# EAGLE design keyboard-8 (EAGLE 9.5.1)

## Sheet 1 of 3
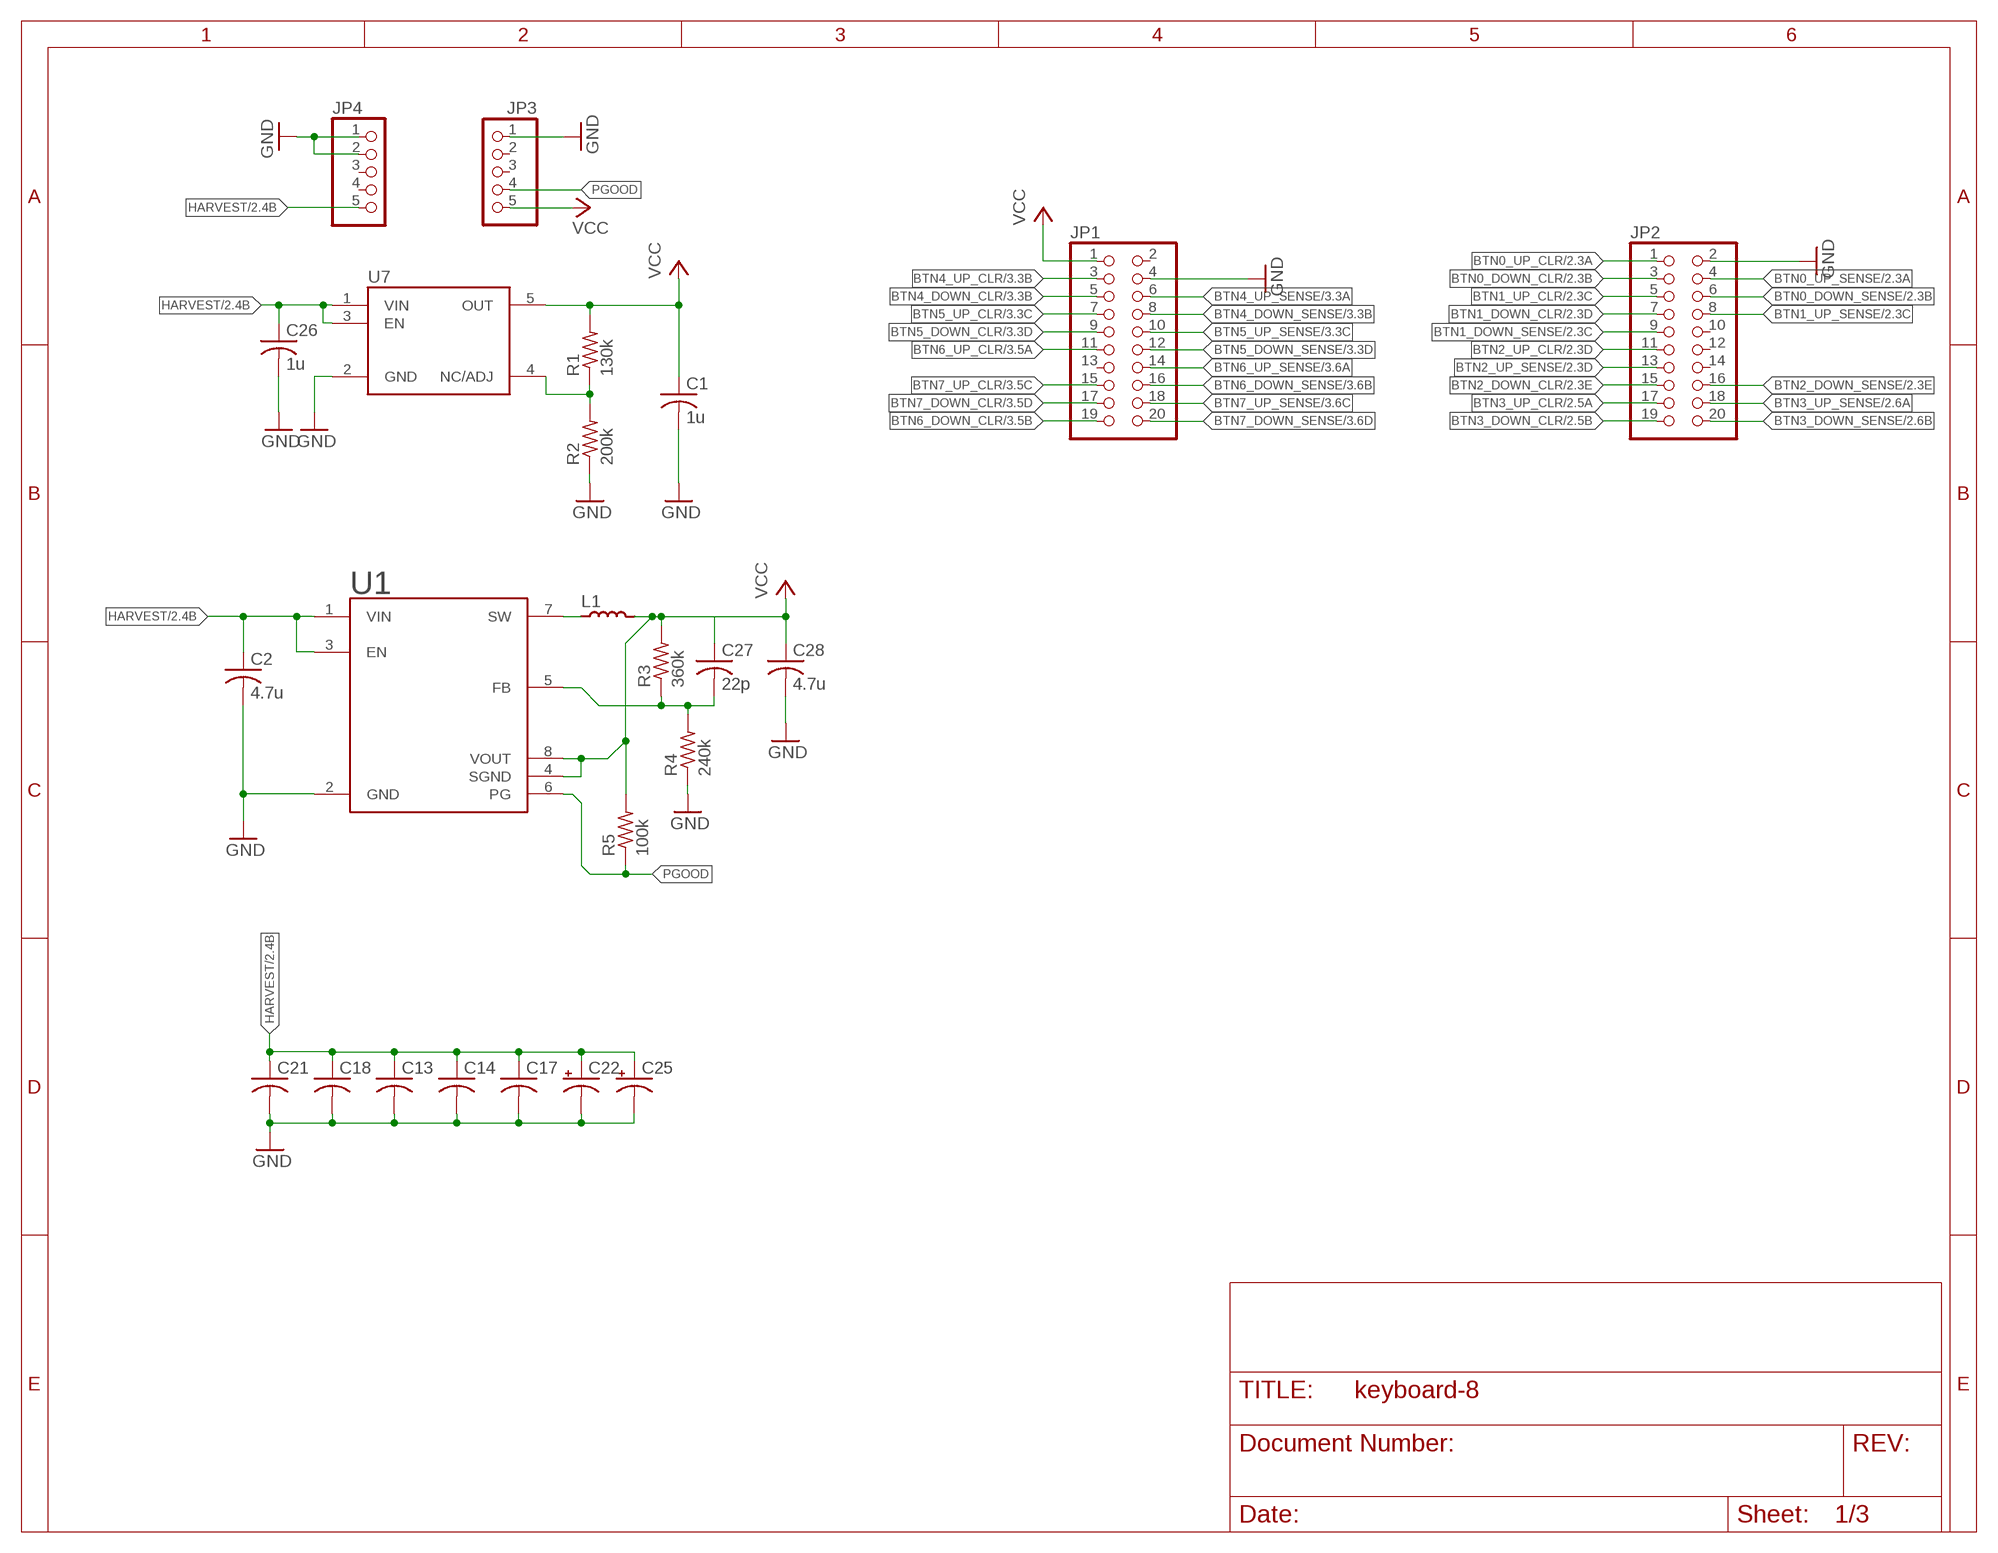
[diagram p0: schematic, sheet 1]

### Parts
C1  1u  C-USC0402  [C0402]
C2  4.7u  C-USC0603  [C0603]
C13  C-USC1206  [C1206]
C14  C-USC1206  [C1206]
C17  C-USC1206  [C1206]
C18  C-USC0805  [C0805]
C21  C-USC0805  [C0805]
C22  CPOL-USE2-5  [E2-5]
C25  CPOL-USE2-5  [E2-5]
C26  1u  C-USC0402  [C0402]
C27  22p  C-USC0402  [C0402]
C28  4.7u  C-USC0603  [C0603]
JP1  PINHD-2X10  [2X10]
JP2  PINHD-2X10  [2X10]
JP3  PINHD-1X5  [1X05]
JP4  PINHD-1X5  [1X05]
L1  22u  LQH3NPN220MMEL  [LQH3NPNXXXXMEX]
R1  130k  R-US_R0603  [R0603]
R2  200k  R-US_R0603  [R0603]
R3  360k  R-US_R0402  [R0402]
R4  240k  R-US_R0402  [R0402]
R5  100k  R-US_R0402  [R0402]
U1  TPS62120  [SOP65P280X145-8N]
U7  MIC5225  [MIC5225]

### Nets
BTN0_DOWN_CLR [btn]: JP2.3 ; also sheet 2
BTN0_DOWN_SENSE [btn]: JP2.6 ; also sheet 2
BTN0_UP_CLR [btn]: JP2.1 ; also sheet 2
BTN0_UP_SENSE [btn]: JP2.4 ; also sheet 2
BTN1_DOWN_CLR [btn]: JP2.7 ; also sheet 2
BTN1_DOWN_SENSE [btn]: JP2.9 ; also sheet 2
BTN1_UP_CLR [btn]: JP2.5 ; also sheet 2
BTN1_UP_SENSE [btn]: JP2.8 ; also sheet 2
BTN2_DOWN_CLR [btn]: JP2.15 ; also sheet 2
BTN2_DOWN_SENSE [btn]: JP2.16 ; also sheet 2
BTN2_UP_CLR [btn]: JP2.11 ; also sheet 2
BTN2_UP_SENSE [btn]: JP2.13 ; also sheet 2
BTN3_DOWN_CLR [btn]: JP2.19 ; also sheet 2
BTN3_DOWN_SENSE [btn]: JP2.20 ; also sheet 2
BTN3_UP_CLR [btn]: JP2.17 ; also sheet 2
BTN3_UP_SENSE [btn]: JP2.18 ; also sheet 2
BTN4_DOWN_CLR [btn]: JP1.5 ; also sheet 3
BTN4_DOWN_SENSE [btn]: JP1.8 ; also sheet 3
BTN4_UP_CLR [btn]: JP1.3 ; also sheet 3
BTN4_UP_SENSE [btn]: JP1.6 ; also sheet 3
BTN5_DOWN_CLR [btn]: JP1.9 ; also sheet 3
BTN5_DOWN_SENSE [btn]: JP1.12 ; also sheet 3
BTN5_UP_CLR [btn]: JP1.7 ; also sheet 3
BTN5_UP_SENSE [btn]: JP1.10 ; also sheet 3
BTN6_DOWN_CLR [btn]: JP1.19 ; also sheet 3
BTN6_DOWN_SENSE [btn]: JP1.16 ; also sheet 3
BTN6_UP_CLR [btn]: JP1.11 ; also sheet 3
BTN6_UP_SENSE [btn]: JP1.14 ; also sheet 3
BTN7_DOWN_CLR [btn]: JP1.17 ; also sheet 3
BTN7_DOWN_SENSE [btn]: JP1.20 ; also sheet 3
BTN7_UP_CLR [btn]: JP1.15 ; also sheet 3
BTN7_UP_SENSE [btn]: JP1.18 ; also sheet 3
GND: C1.2 C2.2 C13.2 C14.2 C17.2 C18.2 C21.2 C22.- C25.- C26.2 C28.2 JP1.4 JP2.2 JP3.1 JP4.1 JP4.2 R2.1 R4.1 U1.2(GND) U7.2(GND) ; also sheet 2,3
HARVEST: C2.1 C13.1 C14.1 C17.1 C18.1 C21.1 C22.+ C25.+ C26.1 JP4.5 U1.1(VIN) U1.3(EN) U7.1(VIN) U7.3(EN) ; also sheet 2,3
N$3: R1.1 R2.2 U7.4(NC/ADJ)
N$4: C27.2 R3.1 R4.2 U1.5(FB)
N$5: L1.P$1 U1.7(SW)
PGOOD: JP3.4 R5.1 U1.6(PG)
VCC: C1.1 C27.1 C28.1 JP1.1 JP3.5 L1.P$2 R1.2 R3.2 R5.2 U1.4(SGND) U1.8(VOUT) U7.5(OUT) ; also sheet 2,3
Unconnected: JP1.2 JP1.13 JP2.10 JP2.12 JP2.14 JP3.2 JP3.3 JP4.3 JP4.4

## Sheet 2 of 3
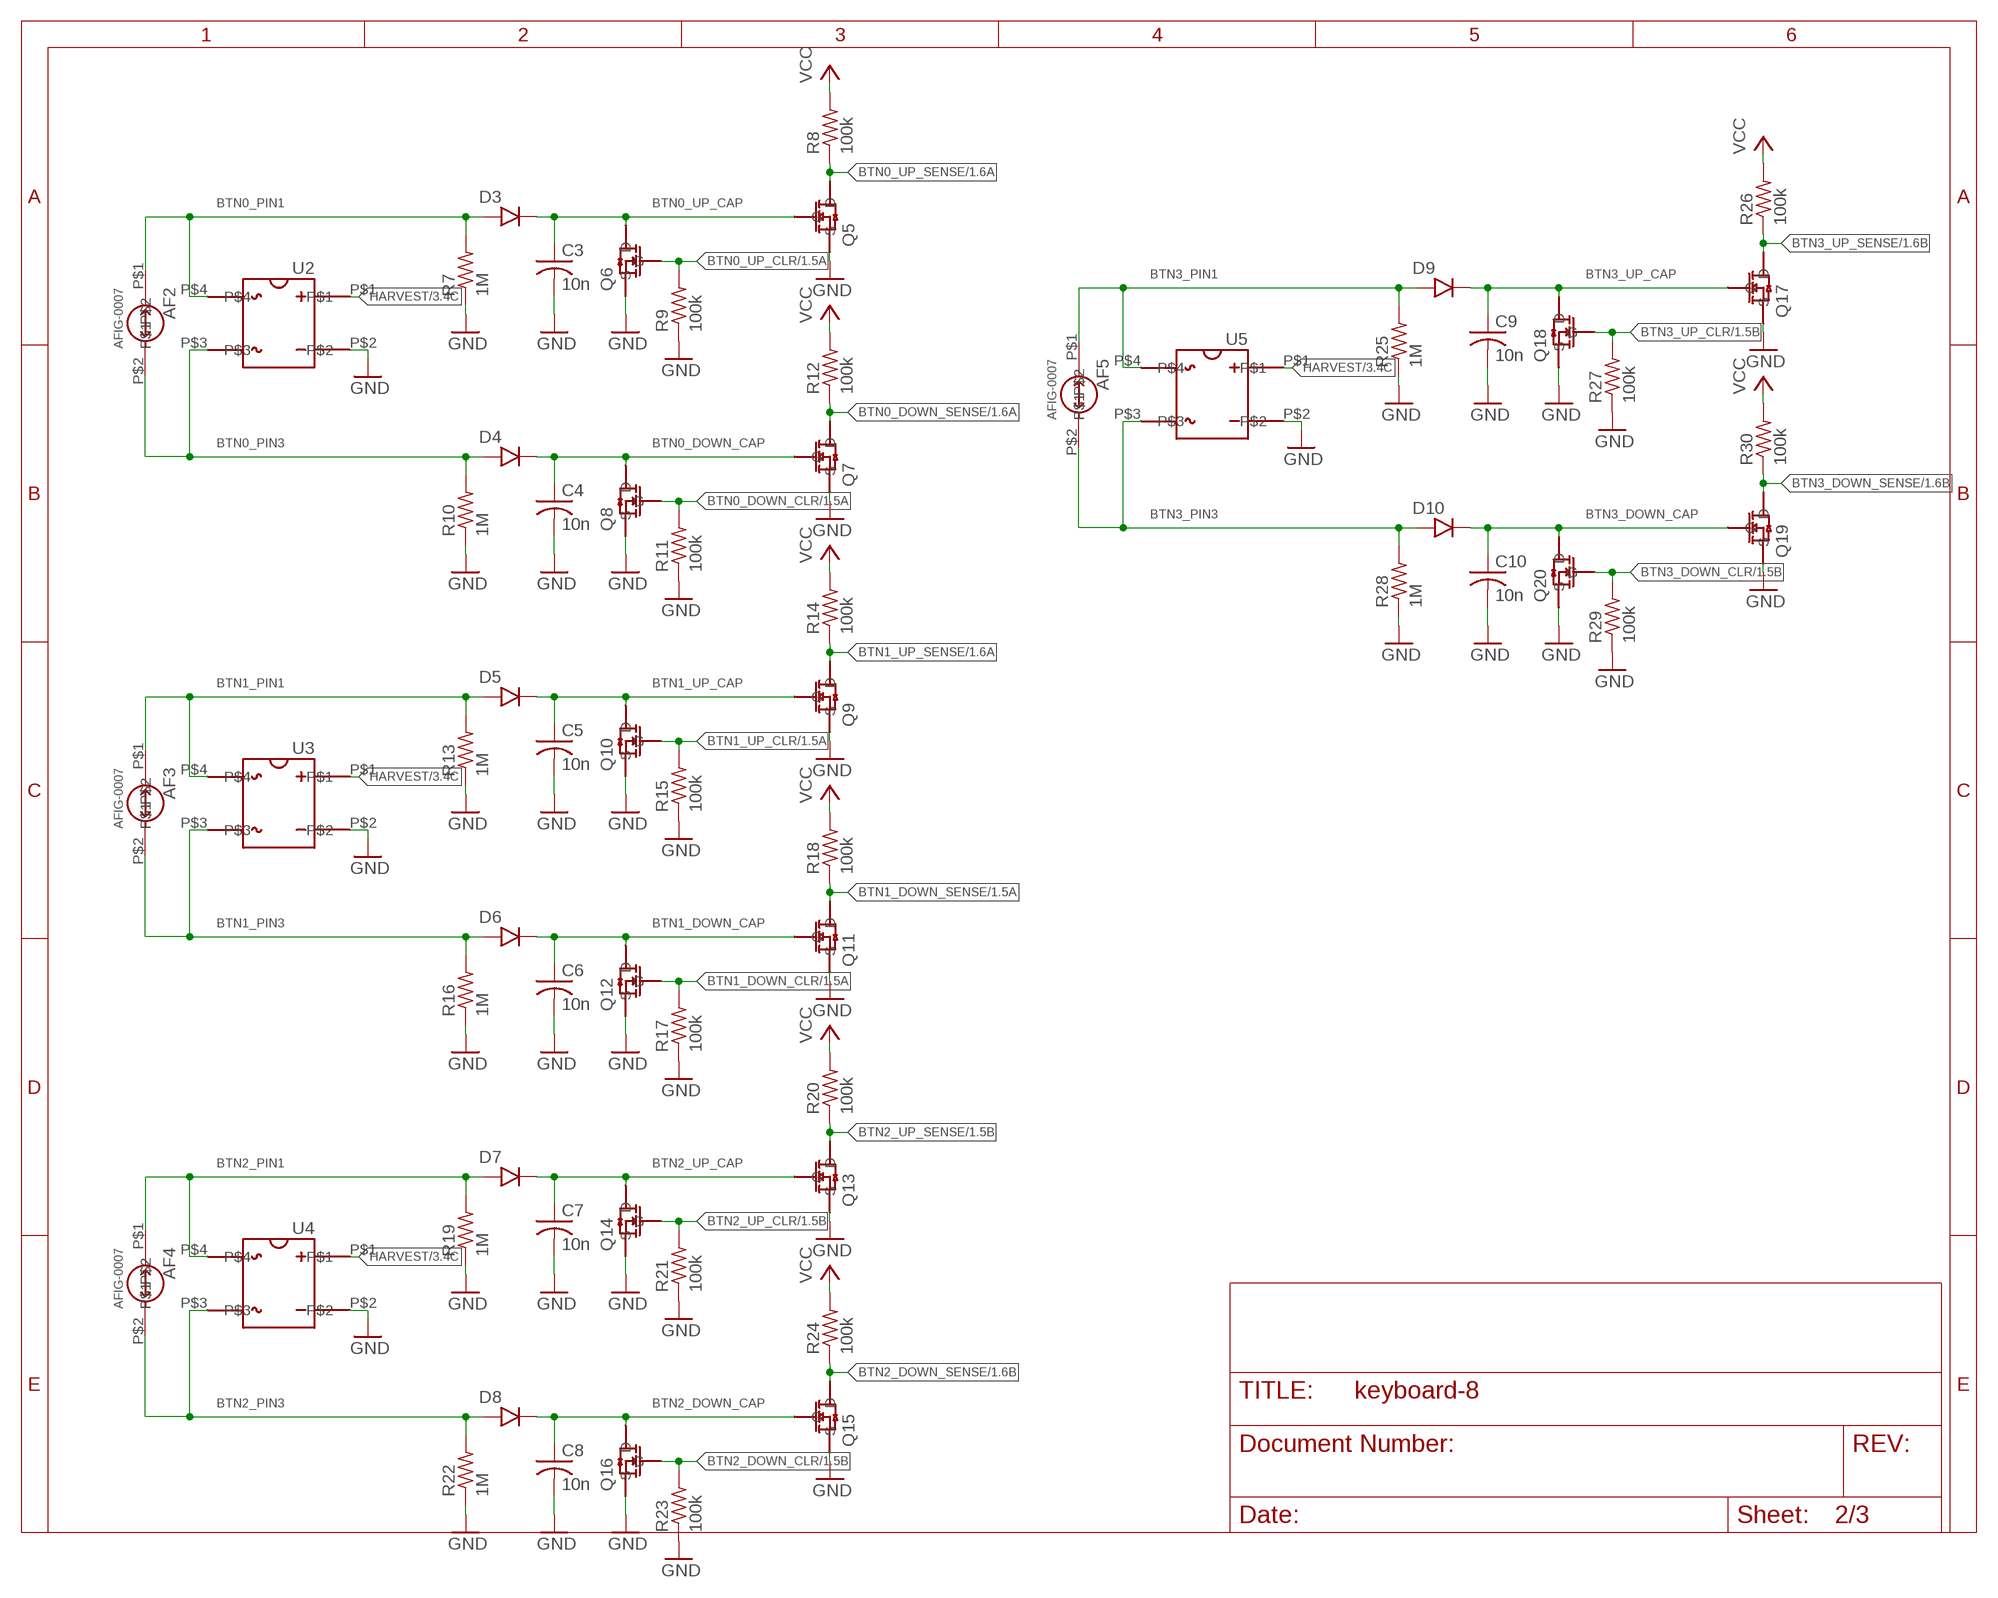
[diagram p1: schematic, sheet 2]

### Parts
AF2  BUTTON-MOUNT  [BUTTON-MOUNT]
AF3  BUTTON-MOUNT  [BUTTON-MOUNT]
AF4  BUTTON-MOUNT  [BUTTON-MOUNT]
AF5  BUTTON-MOUNT  [BUTTON-MOUNT]
C3  10n  C-USC0402  [C0402]
C4  10n  C-USC0402  [C0402]
C5  10n  C-USC0402  [C0402]
C6  10n  C-USC0402  [C0402]
C7  10n  C-USC0402  [C0402]
C8  10n  C-USC0402  [C0402]
C9  10n  C-USC0402  [C0402]
C10  10n  C-USC0402  [C0402]
D3  DFLU1200  [DFLU1200]
D4  DFLU1200  [DFLU1200]
D5  DFLU1200  [DFLU1200]
D6  DFLU1200  [DFLU1200]
D7  DFLU1200  [DFLU1200]
D8  DFLU1200  [DFLU1200]
D9  DFLU1200  [DFLU1200]
D10  DFLU1200  [DFLU1200]
Q5  2N7002K-7  [2N7002K-7]
Q6  BSS138K  [BSS138K]
Q7  2N7002K-7  [2N7002K-7]
Q8  BSS138K  [BSS138K]
Q9  2N7002K-7  [2N7002K-7]
Q10  BSS138K  [BSS138K]
Q11  2N7002K-7  [2N7002K-7]
Q12  BSS138K  [BSS138K]
Q13  2N7002K-7  [2N7002K-7]
Q14  BSS138K  [BSS138K]
Q15  2N7002K-7  [2N7002K-7]
Q16  BSS138K  [BSS138K]
Q17  2N7002K-7  [2N7002K-7]
Q18  BSS138K  [BSS138K]
Q19  2N7002K-7  [2N7002K-7]
Q20  BSS138K  [BSS138K]
R7  1M  R-US_R0402  [R0402]
R8  100k  R-US_R0402  [R0402]
R9  100k  R-US_R0402  [R0402]
R10  1M  R-US_R0402  [R0402]
R11  100k  R-US_R0402  [R0402]
R12  100k  R-US_R0402  [R0402]
R13  1M  R-US_R0402  [R0402]
R14  100k  R-US_R0402  [R0402]
R15  100k  R-US_R0402  [R0402]
R16  1M  R-US_R0402  [R0402]
R17  100k  R-US_R0402  [R0402]
R18  100k  R-US_R0402  [R0402]
R19  1M  R-US_R0402  [R0402]
R20  100k  R-US_R0402  [R0402]
R21  100k  R-US_R0402  [R0402]
R22  1M  R-US_R0402  [R0402]
R23  100k  R-US_R0402  [R0402]
R24  100k  R-US_R0402  [R0402]
R25  1M  R-US_R0402  [R0402]
R26  100k  R-US_R0402  [R0402]
R27  100k  R-US_R0402  [R0402]
R28  1M  R-US_R0402  [R0402]
R29  100k  R-US_R0402  [R0402]
R30  100k  R-US_R0402  [R0402]
U2  CDBHD140L-G  [CDBHDXX0L-G]
U3  CDBHD140L-G  [CDBHDXX0L-G]
U4  CDBHD140L-G  [CDBHDXX0L-G]
U5  CDBHD140L-G  [CDBHDXX0L-G]

### Nets
BTN0_DOWN_CAP [btn]: C4.1 D4.K Q7.G Q8.D
BTN0_DOWN_CLR [btn]: Q8.G R11.2 ; also sheet 1
BTN0_DOWN_SENSE [btn]: Q7.D R12.1 ; also sheet 1
BTN0_PIN1 [btn]: AF2.P$1 D3.A R7.2 U2.P$4
BTN0_PIN3 [btn]: AF2.P$2 D4.A R10.2 U2.P$3
BTN0_UP_CAP [btn]: C3.1 D3.K Q5.G Q6.D
BTN0_UP_CLR [btn]: Q6.G R9.2 ; also sheet 1
BTN0_UP_SENSE [btn]: Q5.D R8.1 ; also sheet 1
BTN1_DOWN_CAP [btn]: C6.1 D6.K Q11.G Q12.D
BTN1_DOWN_CLR [btn]: Q12.G R17.2 ; also sheet 1
BTN1_DOWN_SENSE [btn]: Q11.D R18.1 ; also sheet 1
BTN1_PIN1 [btn]: AF3.P$1 D5.A R13.2 U3.P$4
BTN1_PIN3 [btn]: AF3.P$2 D6.A R16.2 U3.P$3
BTN1_UP_CAP [btn]: C5.1 D5.K Q9.G Q10.D
BTN1_UP_CLR [btn]: Q10.G R15.2 ; also sheet 1
BTN1_UP_SENSE [btn]: Q9.D R14.1 ; also sheet 1
BTN2_DOWN_CAP [btn]: C8.1 D8.K Q15.G Q16.D
BTN2_DOWN_CLR [btn]: Q16.G R23.2 ; also sheet 1
BTN2_DOWN_SENSE [btn]: Q15.D R24.1 ; also sheet 1
BTN2_PIN1 [btn]: AF4.P$1 D7.A R19.2 U4.P$4
BTN2_PIN3 [btn]: AF4.P$2 D8.A R22.2 U4.P$3
BTN2_UP_CAP [btn]: C7.1 D7.K Q13.G Q14.D
BTN2_UP_CLR [btn]: Q14.G R21.2 ; also sheet 1
BTN2_UP_SENSE [btn]: Q13.D R20.1 ; also sheet 1
BTN3_DOWN_CAP [btn]: C10.1 D10.K Q19.G Q20.D
BTN3_DOWN_CLR [btn]: Q20.G R29.2 ; also sheet 1
BTN3_DOWN_SENSE [btn]: Q19.D R30.1 ; also sheet 1
BTN3_PIN1 [btn]: AF5.P$1 D9.A R25.2 U5.P$4
BTN3_PIN3 [btn]: AF5.P$2 D10.A R28.2 U5.P$3
BTN3_UP_CAP [btn]: C9.1 D9.K Q17.G Q18.D
BTN3_UP_CLR [btn]: Q18.G R27.2 ; also sheet 1
BTN3_UP_SENSE [btn]: Q17.D R26.1 ; also sheet 1
GND: C3.2 C4.2 C5.2 C6.2 C7.2 C8.2 C9.2 C10.2 Q5.S Q6.S Q7.S Q8.S Q9.S Q10.S Q11.S Q12.S Q13.S Q14.S Q15.S Q16.S Q17.S Q18.S Q19.S Q20.S R7.1 R9.1 R10.1 R11.1 R13.1 R15.1 R16.1 R17.1 R19.1 R21.1 R22.1 R23.1 R25.1 R27.1 R28.1 R29.1 U2.P$2 U3.P$2 U4.P$2 U5.P$2 ; also sheet 1,3
HARVEST: U2.P$1 U3.P$1 U4.P$1 U5.P$1 ; also sheet 1,3
VCC: R8.2 R12.2 R14.2 R18.2 R20.2 R24.2 R26.2 R30.2 ; also sheet 1,3

## Sheet 3 of 3
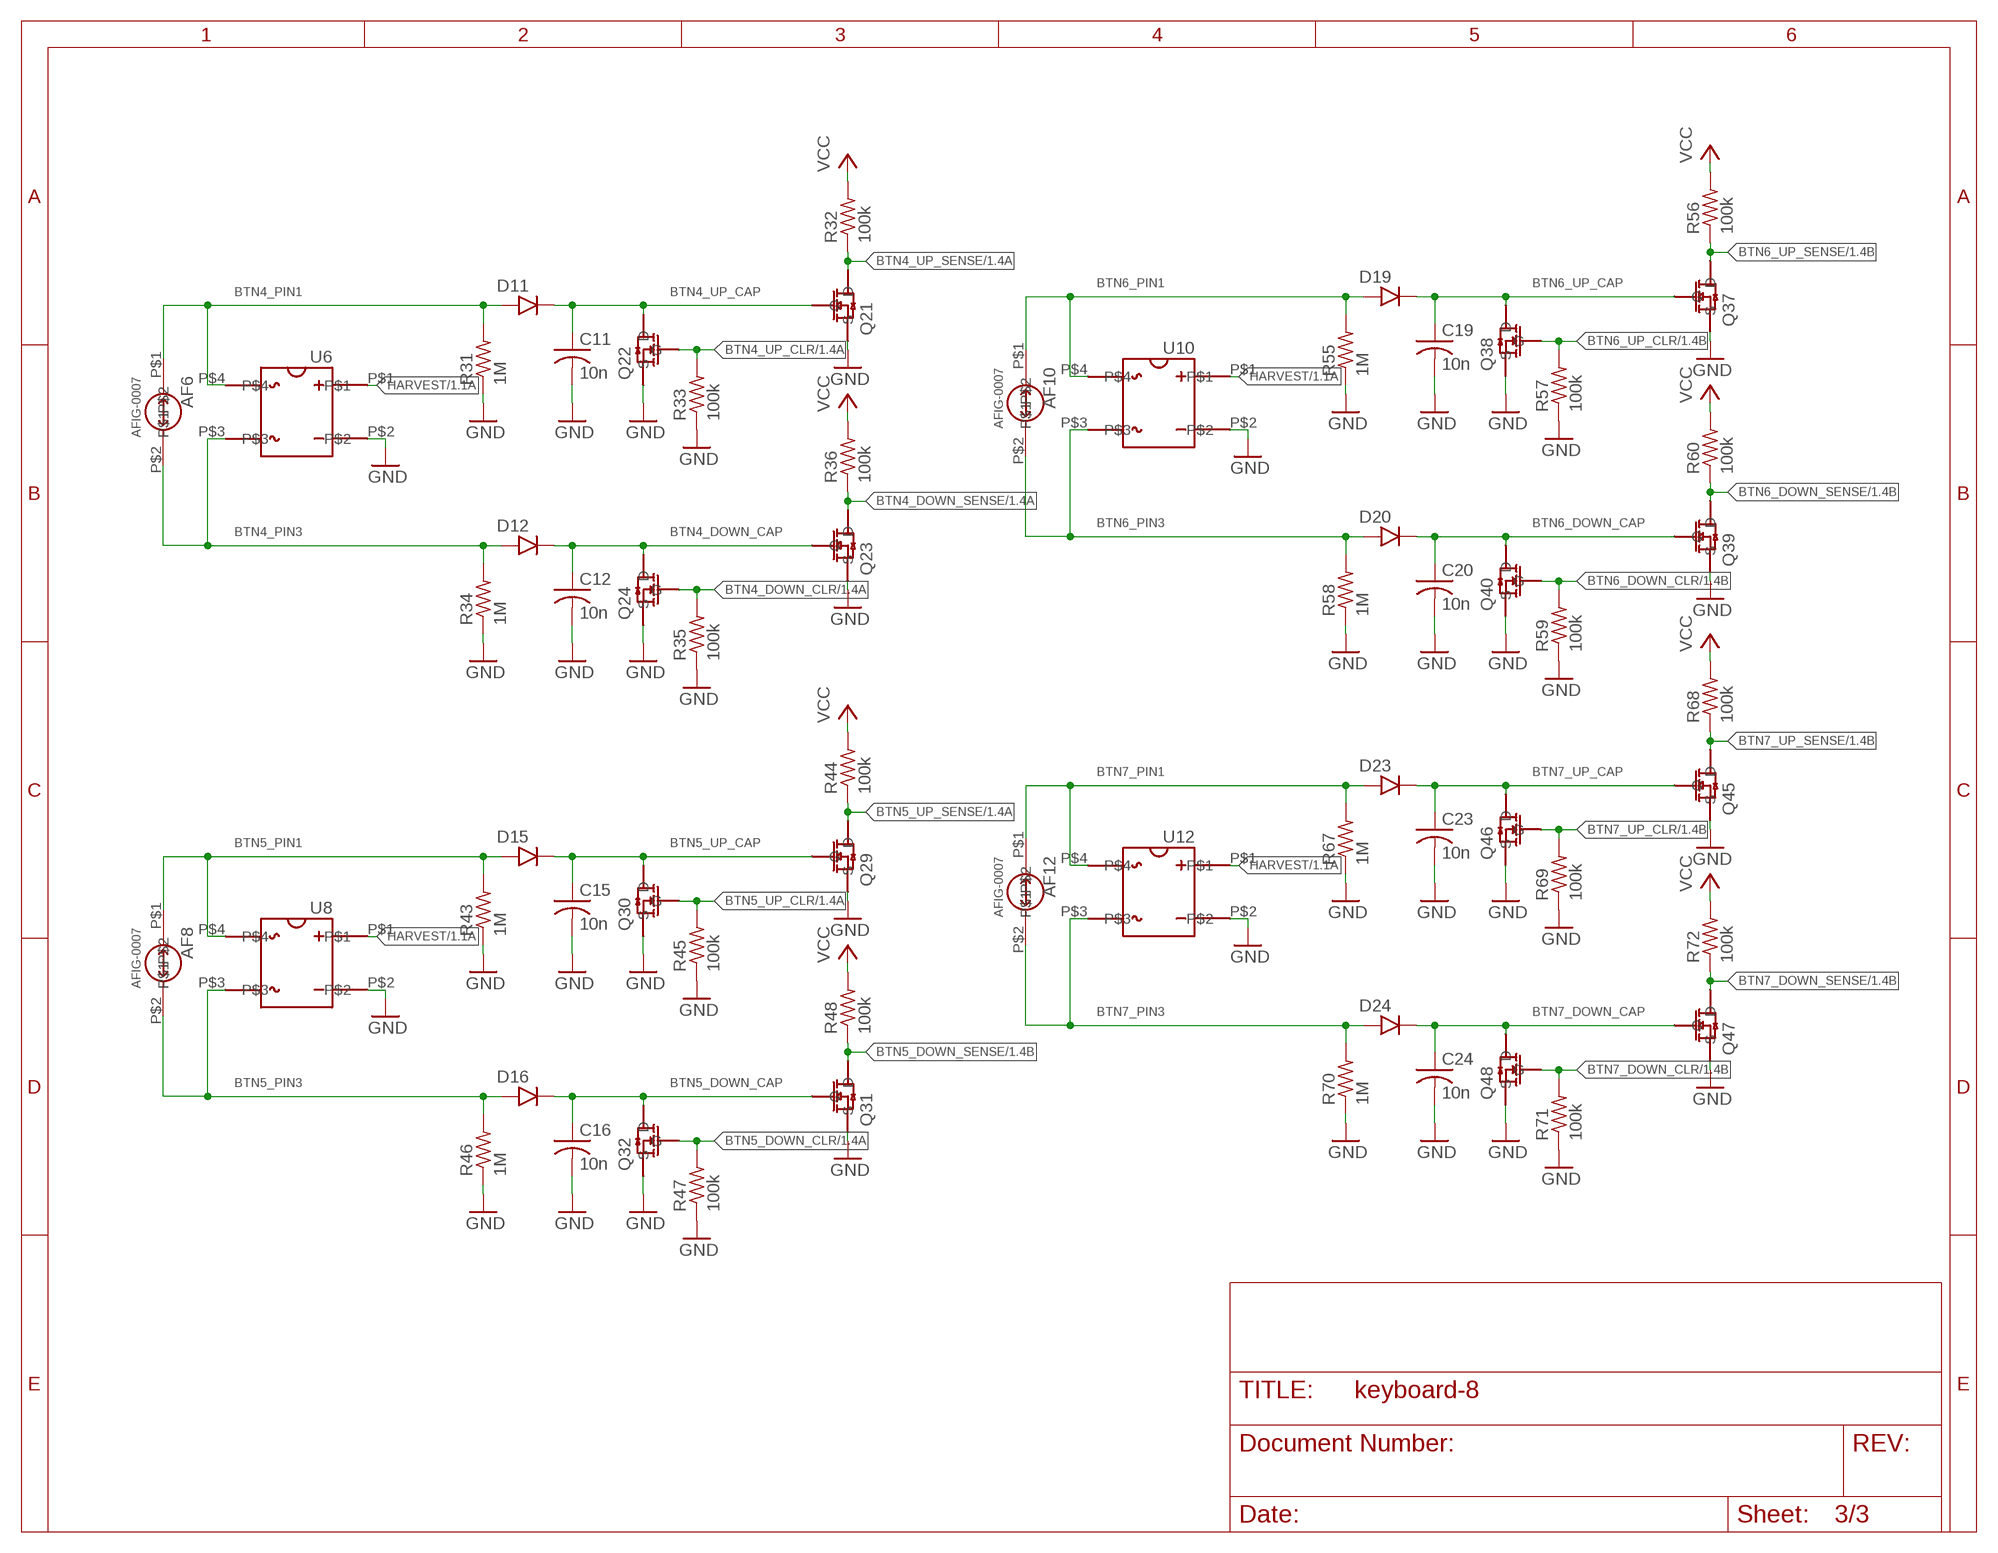
[diagram p2: schematic, sheet 3]

### Parts
AF6  BUTTON-MOUNT  [BUTTON-MOUNT]
AF8  BUTTON-MOUNT  [BUTTON-MOUNT]
AF10  BUTTON-MOUNT  [BUTTON-MOUNT]
AF12  BUTTON-MOUNT  [BUTTON-MOUNT]
C11  10n  C-USC0402  [C0402]
C12  10n  C-USC0402  [C0402]
C15  10n  C-USC0402  [C0402]
C16  10n  C-USC0402  [C0402]
C19  10n  C-USC0402  [C0402]
C20  10n  C-USC0402  [C0402]
C23  10n  C-USC0402  [C0402]
C24  10n  C-USC0402  [C0402]
D11  DFLU1200  [DFLU1200]
D12  DFLU1200  [DFLU1200]
D15  DFLU1200  [DFLU1200]
D16  DFLU1200  [DFLU1200]
D19  DFLU1200  [DFLU1200]
D20  DFLU1200  [DFLU1200]
D23  DFLU1200  [DFLU1200]
D24  DFLU1200  [DFLU1200]
Q21  2N7002K-7  [2N7002K-7]
Q22  BSS138K  [BSS138K]
Q23  2N7002K-7  [2N7002K-7]
Q24  BSS138K  [BSS138K]
Q29  2N7002K-7  [2N7002K-7]
Q30  BSS138K  [BSS138K]
Q31  2N7002K-7  [2N7002K-7]
Q32  BSS138K  [BSS138K]
Q37  2N7002K-7  [2N7002K-7]
Q38  BSS138K  [BSS138K]
Q39  2N7002K-7  [2N7002K-7]
Q40  BSS138K  [BSS138K]
Q45  2N7002K-7  [2N7002K-7]
Q46  BSS138K  [BSS138K]
Q47  2N7002K-7  [2N7002K-7]
Q48  BSS138K  [BSS138K]
R31  1M  R-US_R0402  [R0402]
R32  100k  R-US_R0402  [R0402]
R33  100k  R-US_R0402  [R0402]
R34  1M  R-US_R0402  [R0402]
R35  100k  R-US_R0402  [R0402]
R36  100k  R-US_R0402  [R0402]
R43  1M  R-US_R0402  [R0402]
R44  100k  R-US_R0402  [R0402]
R45  100k  R-US_R0402  [R0402]
R46  1M  R-US_R0402  [R0402]
R47  100k  R-US_R0402  [R0402]
R48  100k  R-US_R0402  [R0402]
R55  1M  R-US_R0402  [R0402]
R56  100k  R-US_R0402  [R0402]
R57  100k  R-US_R0402  [R0402]
R58  1M  R-US_R0402  [R0402]
R59  100k  R-US_R0402  [R0402]
R60  100k  R-US_R0402  [R0402]
R67  1M  R-US_R0402  [R0402]
R68  100k  R-US_R0402  [R0402]
R69  100k  R-US_R0402  [R0402]
R70  1M  R-US_R0402  [R0402]
R71  100k  R-US_R0402  [R0402]
R72  100k  R-US_R0402  [R0402]
U6  CDBHD140L-G  [CDBHDXX0L-G]
U8  CDBHD140L-G  [CDBHDXX0L-G]
U10  CDBHD140L-G  [CDBHDXX0L-G]
U12  CDBHD140L-G  [CDBHDXX0L-G]

### Nets
BTN4_DOWN_CAP [btn]: C12.1 D12.K Q23.G Q24.D
BTN4_DOWN_CLR [btn]: Q24.G R35.2 ; also sheet 1
BTN4_DOWN_SENSE [btn]: Q23.D R36.1 ; also sheet 1
BTN4_PIN1 [btn]: AF6.P$1 D11.A R31.2 U6.P$4
BTN4_PIN3 [btn]: AF6.P$2 D12.A R34.2 U6.P$3
BTN4_UP_CAP [btn]: C11.1 D11.K Q21.G Q22.D
BTN4_UP_CLR [btn]: Q22.G R33.2 ; also sheet 1
BTN4_UP_SENSE [btn]: Q21.D R32.1 ; also sheet 1
BTN5_DOWN_CAP [btn]: C16.1 D16.K Q31.G Q32.D
BTN5_DOWN_CLR [btn]: Q32.G R47.2 ; also sheet 1
BTN5_DOWN_SENSE [btn]: Q31.D R48.1 ; also sheet 1
BTN5_PIN1 [btn]: AF8.P$1 D15.A R43.2 U8.P$4
BTN5_PIN3 [btn]: AF8.P$2 D16.A R46.2 U8.P$3
BTN5_UP_CAP [btn]: C15.1 D15.K Q29.G Q30.D
BTN5_UP_CLR [btn]: Q30.G R45.2 ; also sheet 1
BTN5_UP_SENSE [btn]: Q29.D R44.1 ; also sheet 1
BTN6_DOWN_CAP [btn]: C20.1 D20.K Q39.G Q40.D
BTN6_DOWN_CLR [btn]: Q40.G R59.2 ; also sheet 1
BTN6_DOWN_SENSE [btn]: Q39.D R60.1 ; also sheet 1
BTN6_PIN1 [btn]: AF10.P$1 D19.A R55.2 U10.P$4
BTN6_PIN3 [btn]: AF10.P$2 D20.A R58.2 U10.P$3
BTN6_UP_CAP [btn]: C19.1 D19.K Q37.G Q38.D
BTN6_UP_CLR [btn]: Q38.G R57.2 ; also sheet 1
BTN6_UP_SENSE [btn]: Q37.D R56.1 ; also sheet 1
BTN7_DOWN_CAP [btn]: C24.1 D24.K Q47.G Q48.D
BTN7_DOWN_CLR [btn]: Q48.G R71.2 ; also sheet 1
BTN7_DOWN_SENSE [btn]: Q47.D R72.1 ; also sheet 1
BTN7_PIN1 [btn]: AF12.P$1 D23.A R67.2 U12.P$4
BTN7_PIN3 [btn]: AF12.P$2 D24.A R70.2 U12.P$3
BTN7_UP_CAP [btn]: C23.1 D23.K Q45.G Q46.D
BTN7_UP_CLR [btn]: Q46.G R69.2 ; also sheet 1
BTN7_UP_SENSE [btn]: Q45.D R68.1 ; also sheet 1
GND: C11.2 C12.2 C15.2 C16.2 C19.2 C20.2 C23.2 C24.2 Q21.S Q22.S Q23.S Q24.S Q29.S Q30.S Q31.S Q32.S Q37.S Q38.S Q39.S Q40.S Q45.S Q46.S Q47.S Q48.S R31.1 R33.1 R34.1 R35.1 R43.1 R45.1 R46.1 R47.1 R55.1 R57.1 R58.1 R59.1 R67.1 R69.1 R70.1 R71.1 U6.P$2 U8.P$2 U10.P$2 U12.P$2 ; also sheet 1,2
HARVEST: U6.P$1 U8.P$1 U10.P$1 U12.P$1 ; also sheet 1,2
VCC: R32.2 R36.2 R44.2 R48.2 R56.2 R60.2 R68.2 R72.2 ; also sheet 1,2

## Library data of the parts
AF2-AF6 AF8 AF10 AF12 = afig-0007:BUTTON-MOUNT
C1-C21 C23 C24 C26-C28 = rcl:C-US: CAPACITOR, American symbol; SPICEPREFIX: C
C22 C25 = rcl:CPOL-US: POLARIZED CAPACITOR, American symbol; SPICEPREFIX: C
D3-D12 D15 D16 D19 D20 D23 D24 = afig-0007:DFLU1200
JP1 JP2 = pinhead:PINHD-2X10: PIN HEADER
JP3 JP4 = pinhead:PINHD-1X5: PIN HEADER
L1 = afig-0007:LQH3NPN220MMEL
Q5 Q7 Q9 Q11 Q13 Q15 Q17 Q19 Q21 Q23 Q29 Q31 Q37 Q39 Q45 Q47 = afig-0007:2N7002K-7
Q6 Q8 Q10 Q12 Q14 Q16 Q18 Q20 Q22 Q24 Q30 Q32 Q38 Q40 Q46 Q48 = afig-0007:BSS138K
R1-R5 R7-R36 R43-R48 R55-R60 R67-R72 = rcl:R-US_: RESISTOR, American symbol; SPICEPREFIX: R
U1 = afig-0007:TPS62120
U2-U6 U8 U10 U12 = afig-0007:CDBHD140L-G
U7 = afig-0007:MIC5225

## Board
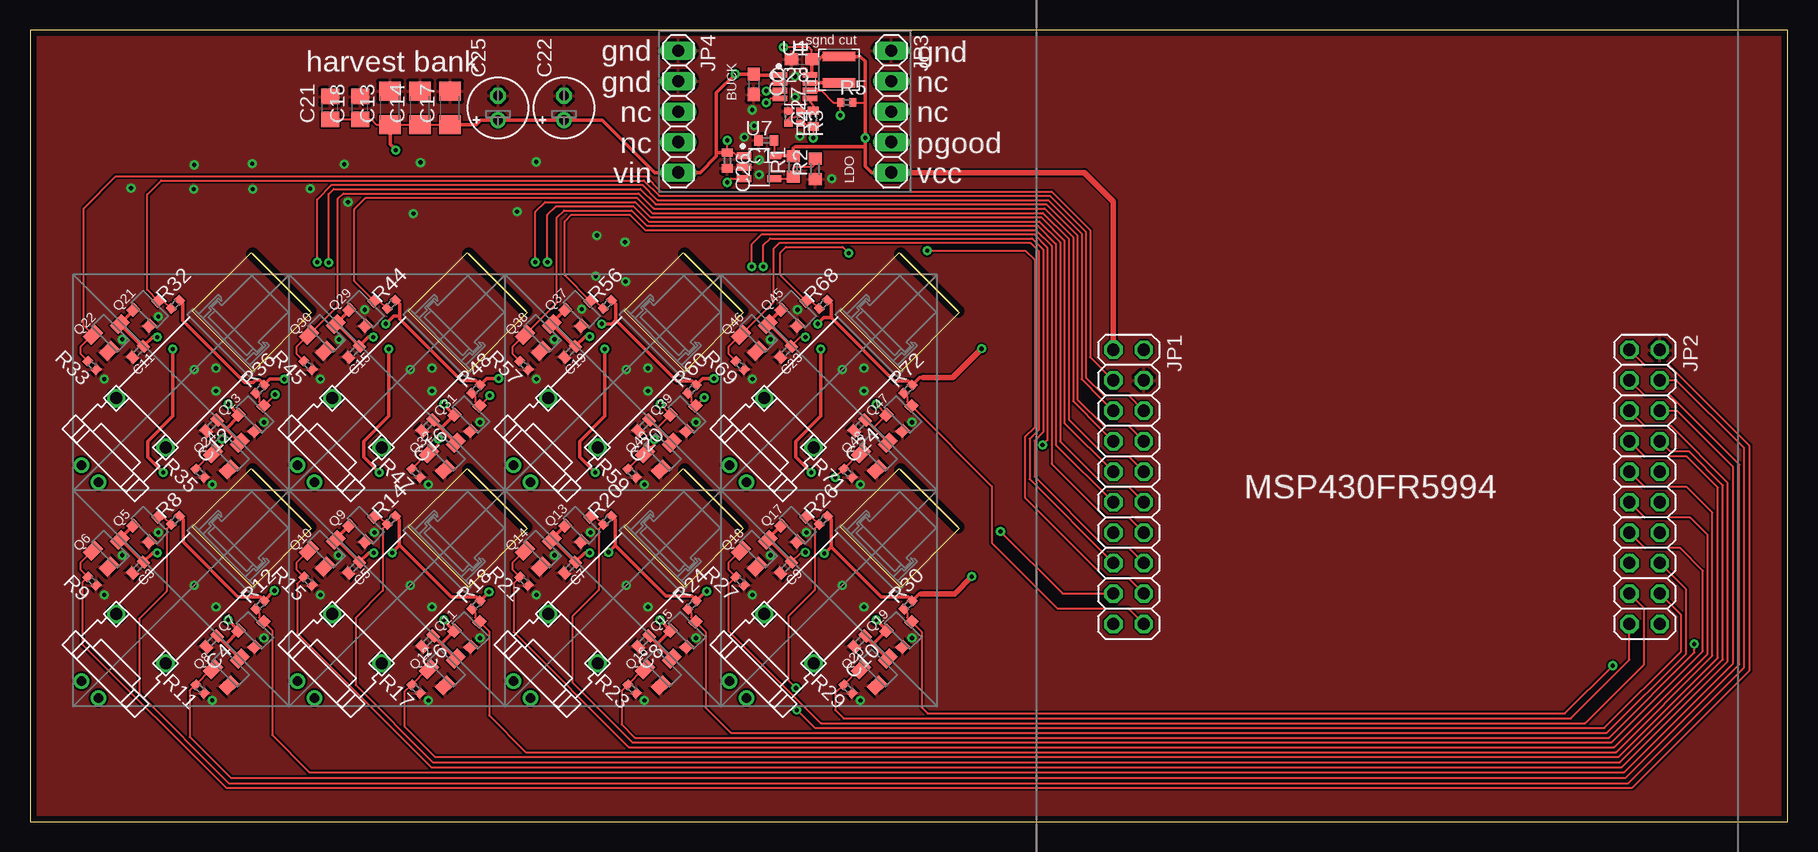
[diagram p3: board, top side]
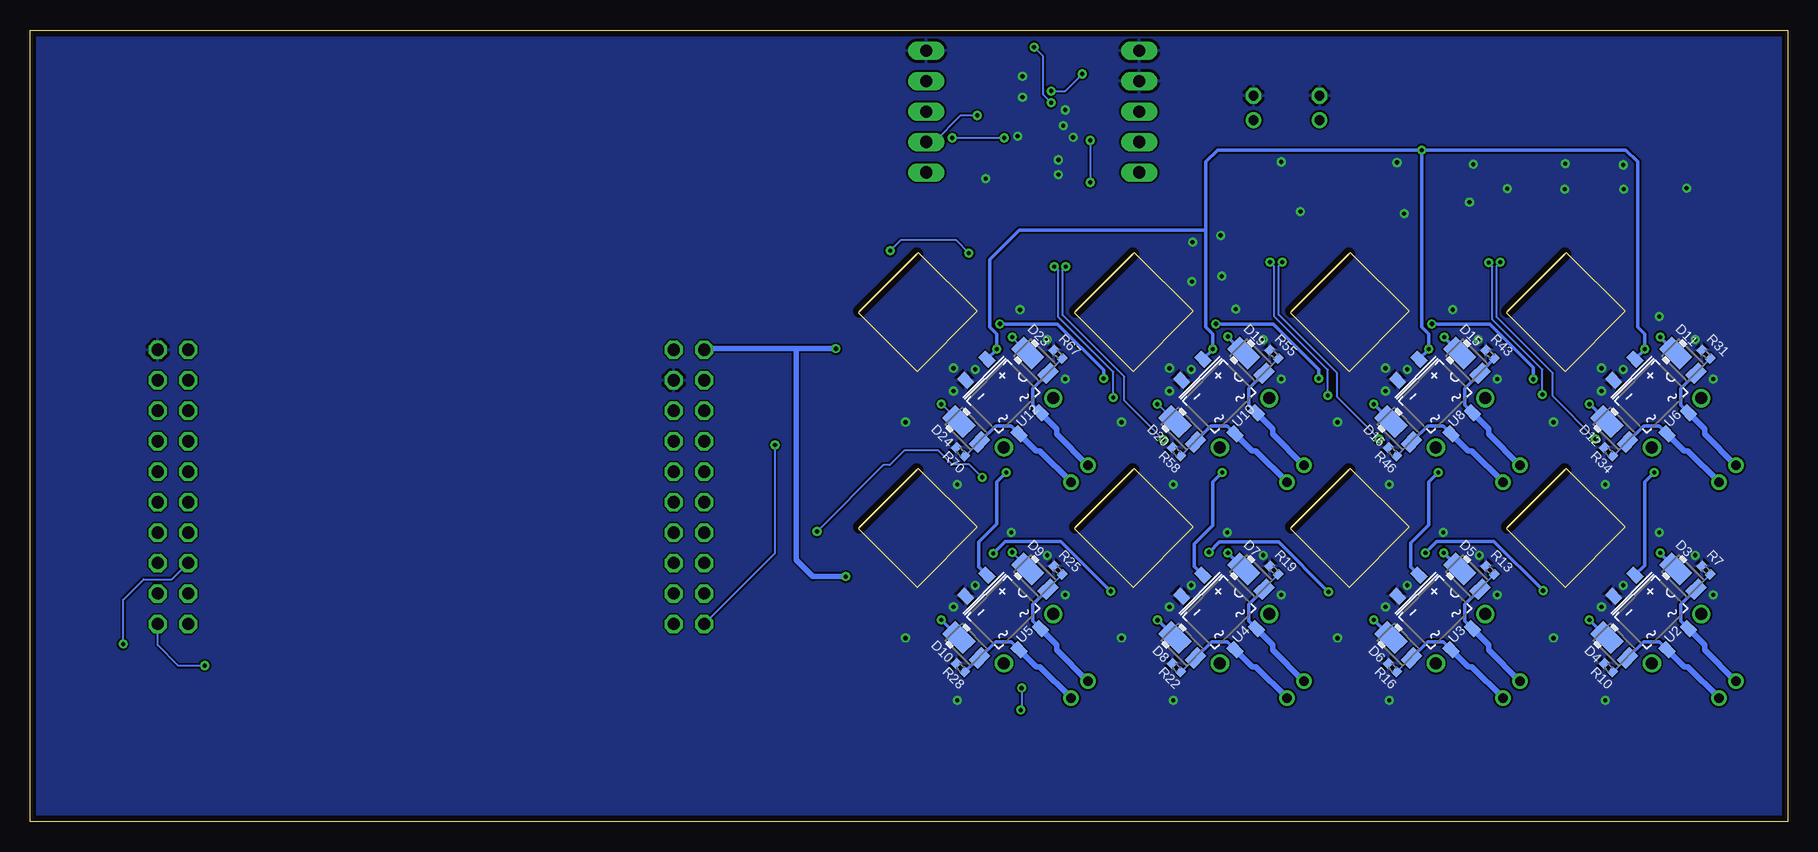
[diagram p4: board, bottom side, seen from below]

Size 146.46 x 66 mm. Coordinates in mm from the lower left corner, seen from the top.
Outline: 0,0 146.46,0 146.46,66 0,66 0,0
Copper layers (1*16): Top 0.035mm / dielectric 1.5mm / Bottom 0.035mm
Design rules "default *": minimum track width 6mil, minimum drill 0.35mm, track to track 6mil, track to pad 6mil, pad to pad 6mil, via to via 6mil, smd to smd 6mil, copper to edge 20mil, drill to drill 6mil, minimum pad ring 10mil, minimum via ring 8mil, stop-mask expansion 4mil, vias tented up to drill 15mil, thermal gap 10mil

### Footprints (pad centres in the part's own frame; a part is rotated, then mirrored left to right if it is on the bottom)
BUTTON-MOUNT = drill 0.8: P$1 0,1; P$2 0,-1 | drill 1: P$3 6,-2.9; P$4 6,2.9
C0402 = smd 0.7 x 0.9: 1 -0.65,0; 2 0.65,0
C0603 = smd 1.1 x 1: 1 -0.85,0; 2 0.85,0
C1206 = smd 1.6 x 1.8: 1 -1.4,0; 2 1.4,0
C0805 = smd 1.3 x 1.5: 1 -0.95,0; 2 0.95,0
E2-5 = drill 0.813 pad 1.27: + -1.016,0 | drill 0.813 pad 1.27 octagon: - 1.016,0
DFLU1200 = smd 1.05 x 1.5: A -1.55,0 | smd 2.4 x 1.5: K 0.85,0
2X10 = drill 1.016 octagon: 1 -11.43,-1.27; 2 -11.43,1.27; 3 -8.89,-1.27; 4 -8.89,1.27; 5 -6.35,-1.27; 6 -6.35,1.27; 7 -3.81,-1.27; 8 -3.81,1.27; 9 -1.27,-1.27; 10 -1.27,1.27; 11 1.27,-1.27; 12 1.27,1.27; 13 3.81,-1.27; 14 3.81,1.27; 15 6.35,-1.27; 16 6.35,1.27; 17 8.89,-1.27; 18 8.89,1.27; 19 11.43,-1.27; 20 11.43,1.27
1X05 = drill 1.016 long: 1 -5.08,0; 2 -2.54,0; 3 0,0; 4 2.54,0; 5 5.08,0
LQH3NPNXXXXMEX = smd 0.8 x 2.7: P$1 -1.1,0; P$2 1.1,0
2N7002K-7 = smd 0.8 x 0.9: D 0,1; G -0.95,-1; S 0.95,-1
BSS138K = smd 1 x 1.4: D 0,1.1; G -0.95,-1.1; S 0.95,-1.1
R0603 = smd 1 x 1.1: 1 -0.85,0; 2 0.85,0
R0402 = smd 0.6 x 0.7: 1 -0.5,0; 2 0.5,0
SOP65P280X145-8N = smd 1.209 x 0.475: 1 -1.253,0.975; 2 -1.253,0.325; 3 -1.253,-0.325; 4 -1.253,-0.975; 5 1.253,-0.975; 6 1.253,-0.325; 7 1.253,0.325; 8 1.253,0.975
CDBHDXX0L-G = smd 0.85 x 1.2: P$1 1.25,3.15; P$2 -1.25,3.15; P$3 -1.25,-3.15; P$4 1.25,-3.15
MIC5225 = smd 1.186 x 0.584: 1 -1.264,0.95; 2 -1.264,0; 3 -1.264,-0.95; 4 1.264,-0.95; 5 1.264,0.95

### Placement (x,y rotation side)
AF2  5,11 45 top
AF3  23,11 45 top
AF4  41,11 45 top
AF5  59,11 45 top
AF6  5,29 45 top
AF8  23,29 45 top
AF10  41,29 45 top
AF12  59,29 45 top
C1  61.37,56.79 180 top
C2  60.3,61.47 270 top
C3  8.99,21.17 225 top
C4  15.15,15.02 225 top
C5  26.99,21.17 225 top
C6  33.15,15.02 225 top
C7  44.99,21.17 225 top
C8  51.15,15.02 225 top
C9  62.99,21.17 225 top
C10  69.15,15.02 225 top
C11  8.99,39.17 225 top
C12  15.15,33.02 225 top
C13  30,59.5 90 top
C14  32.5,59.5 90 top
C15  26.99,39.17 225 top
C16  33.15,33.02 225 top
C17  35,59.5 90 top
C18  27.5,59.5 90 top
C19  44.99,39.17 225 top
C20  51.15,33.02 225 top
C21  25,59.5 90 top
C22  44.5,59.5 90 top
C23  62.99,39.17 225 top
C24  69.15,33.02 225 top
C25  39,59.5 90 top
C26  58.12,55.12 270 top
C27  65.28,58.62 90 top
C28  64.31,63.55 180 top
D3  8.71,20.46 135 bottom
D4  14.44,14.74 135 bottom
D5  26.71,20.46 135 bottom
D6  32.44,14.74 135 bottom
D7  44.71,20.46 135 bottom
D8  50.44,14.74 135 bottom
D9  62.71,20.46 135 bottom
D10  68.44,14.74 135 bottom
D11  8.71,38.46 135 bottom
D12  14.44,32.74 135 bottom
D15  26.71,38.46 135 bottom
D16  32.44,32.74 135 bottom
D19  44.71,38.46 135 bottom
D20  50.44,32.74 135 bottom
D23  62.71,38.46 135 bottom
D24  68.44,32.74 135 bottom
JP1  91.55,27.9 270 top
JP2  134.55,27.9 270 top
JP3  71.78,59.2 270 top
JP4  54.02,59.2 270 top
L1  67.41,62.69 90 top
Q5  9.98,24.71 315 top
Q6  6.7,22.7 315 top
Q7  18.75,15.94 315 top
Q8  16.7,12.8 315 top
Q9  27.98,24.71 315 top
Q10  24.7,22.7 315 top
Q11  36.75,15.94 315 top
Q12  34.7,12.8 315 top
Q13  45.98,24.71 315 top
Q14  42.7,22.7 315 top
Q15  54.75,15.94 315 top
Q16  52.7,12.8 315 top
Q17  63.98,24.71 315 top
Q18  60.7,22.7 315 top
Q19  72.75,15.94 315 top
Q20  70.7,12.8 315 top
Q21  9.98,42.71 315 top
Q22  6.7,40.7 315 top
Q23  18.75,33.94 315 top
Q24  16.7,30.8 315 top
Q29  27.98,42.71 315 top
Q30  24.7,40.7 315 top
Q31  36.75,33.94 315 top
Q32  34.7,30.8 315 top
Q37  45.98,42.71 315 top
Q38  42.7,40.7 315 top
Q39  54.75,33.94 315 top
Q40  52.7,30.8 315 top
Q45  63.98,42.71 315 top
Q46  60.7,40.7 315 top
Q47  72.75,33.94 315 top
Q48  70.7,30.8 315 top
R1  63.6,54.61 90 top
R2  65.43,54.41 90 top
R3  64.21,58.72 270 top
R4  63.2,58.72 270 top
R5  68.07,59.94 0 top
R7  6.8,20.96 315 bottom
R8  12.11,25.13 45 top
R9  5.18,20.04 135 top
R10  14.93,12.83 315 bottom
R11  14.16,11.06 135 top
R12  19.18,18.06 45 top
R13  24.8,20.96 315 bottom
R14  30.11,25.13 45 top
R15  23.18,20.04 135 top
R16  32.93,12.83 315 bottom
R17  32.16,11.06 135 top
R18  37.18,18.06 45 top
R19  42.8,20.96 315 bottom
R20  48.11,25.13 45 top
R21  41.18,20.04 135 top
R22  50.93,12.83 315 bottom
R23  50.16,11.06 135 top
R24  55.18,18.06 45 top
R25  60.8,20.96 315 bottom
R26  66.11,25.13 45 top
R27  59.18,20.04 135 top
R28  68.93,12.83 315 bottom
R29  68.16,11.06 135 top
R30  73.18,18.06 45 top
R31  6.8,38.96 315 bottom
R32  12.11,43.13 45 top
R33  5.18,38.04 135 top
R34  14.93,30.83 315 bottom
R35  14.16,29.06 135 top
R36  19.18,36.06 45 top
R43  24.8,38.96 315 bottom
R44  30.11,43.13 45 top
R45  23.18,38.04 135 top
R46  32.93,30.83 315 bottom
R47  32.16,29.06 135 top
R48  37.18,36.06 45 top
R55  42.8,38.96 315 bottom
R56  48.11,43.13 45 top
R57  41.18,38.04 135 top
R58  50.93,30.83 315 bottom
R59  50.16,29.06 135 top
R60  55.18,36.06 45 top
R67  60.8,38.96 315 bottom
R68  66.11,43.13 45 top
R69  59.18,38.04 135 top
R70  68.93,30.83 315 bottom
R71  68.16,29.06 135 top
R72  73.18,36.06 45 top
U1  63.75,61.26 0 top
U2  11.37,17.43 45 bottom
U3  29.37,17.43 45 bottom
U4  47.37,17.43 45 bottom
U5  65.37,17.43 45 bottom
U6  11.37,35.43 45 bottom
U7  60.76,54.56 0 top
U8  29.37,35.43 45 bottom
U10  47.37,35.43 45 bottom
U12  65.37,35.43 45 bottom

### Tracks (layer width: path | path; a pad name or v marks a point on that pad's centre or on a via)
BTN0_DOWN_CAP  (via drill 0.35)
  Top 0.152: Q8.D 17.48,13.61
  Top 0.305: 17.48,13.61 16.3,14.78 | 16.3,14.78 C4.1 | v16.51,16.82 17.37,15.95 Q7.G 17.37,15.85 16.3,14.78
  Bottom 0.305: D4.K v16.51,16.81 v16.51,16.82
BTN0_DOWN_CLR
  Top 0.152: JP2.3 134.56,35.51 136.7,35.51 142.44,29.77 142.44,13.11 132.99,3.66 16.71,3.66 13.31,7.06 13.31,10.92 R11.2 15.08,12.69 Q8.G
BTN0_DOWN_SENSE
  Top 0.152: R12.1 19.1,17.43 19.1,17 Q7.D 20.17,15.94 20.17,7.21 23.27,4.12 132.84,4.12 141.94,13.21 141.94,29.57 137.25,34.25 JP2.6
BTN0_PIN1
  Bottom 0.152: R7.2 7.62,19.44 D3.A
  Bottom 0.305: D3.A 8.9,18.08 8.9,16.73 U2.P$4
  Bottom 0.457: U2.P$4 6.9,14.73 6.9,14.3 4.31,11.71 AF2.P$1
BTN0_PIN3
  Bottom 0.152: R10.2 14.51,12.47 D4.A
  Bottom 0.305: U2.P$3 10.71,15 11.98,15 D4.A
  Bottom 0.457: U2.P$3 8.61,12.9 8.3,12.9 5.71,10.31 AF2.P$2
BTN0_UP_CAP  (via drill 0.35)
  Top 0.305: Q5.G 7.48,23.55 Q6.D 7.61,23.48 C3.1 10.22,22.4 v10.6,22.4
  Bottom 0.305: D3.K 10.6,22.35 v10.6,22.4
BTN0_UP_CLR
  Top 0.152: Q6.G 4.2,21.54 4.2,21.02 R9.2 4.37,19.94 4.37,14.78 16.36,2.79 35.66,2.79 35.71,2.79 133.5,2.79 143.31,12.6 143.31,31.29 136.55,38.05 134.56,38.05 JP2.1
BTN0_UP_SENSE
  Top 0.152: JP2.4 137.2,36.79 142.85,31.14 142.85,12.85 133.2,3.2 16.56,3.2 9.09,10.67 9.09,16.92 11.38,19.2 11.38,24.41 R8.1 11.12,25.41 Q5.D
BTN1_DOWN_CAP  (via drill 0.35)
  Top 0.305: v34.49,16.82 34.49,16.78 Q11.G 34.28,14.81 34.27,14.81 | C6.1 34.27,14.81 | 34.27,14.81 35.48,13.61 Q12.D
  Bottom 0.305: v34.49,16.82 33.04,15.36 D6.K
BTN1_DOWN_CLR
  Top 0.152: JP2.7 134.56,30.43 138.07,30.43 140.66,27.84 140.66,13.66 132.38,5.38 33.73,5.38 31.19,7.92 31.19,10.8 R17.2 33.08,12.69 Q12.G
BTN1_DOWN_SENSE
  Top 0.152: R18.1 37.1,17.43 37.1,17 Q11.D 38.25,15.85 38.25,8.84 41.3,5.79 132.18,5.79 140.21,13.82 140.21,25.76 138.07,27.89 134.56,27.89 JP2.9
BTN1_PIN1
  Bottom 0.152: R13.2 25.61,19.44 D5.A
  Bottom 0.305: D5.A 26.9,18.08 26.9,16.73 U3.P$4
  Bottom 0.457: U3.P$4 24.9,14.73 24.9,14.3 22.31,11.71 AF3.P$1
BTN1_PIN3
  Bottom 0.152: R16.2 31.41,13.64 D6.A 31.39,13.59
  Bottom 0.305: U3.P$3 28.71,15 29.98,15 31.39,13.59
  Bottom 0.457: U3.P$3 26.61,12.9 26.3,12.9 23.71,10.31 AF3.P$2
BTN1_UP_CAP  (via drill 0.35)
  Top 0.305: v28.65,22.4 28.23,22.4 C5.1 25.61,23.48 | Q10.D 25.61,23.48 | Q9.G 25.61,23.67 25.61,23.48
  Bottom 0.305: D5.K v28.65,22.4
BTN1_UP_CLR
  Top 0.152: Q10.G 22.2,21.54 22.2,21.02 R15.2 22.25,19.82 22.25,15.7 33.43,4.52 132.64,4.52 141.48,13.36 141.48,28.25 136.75,32.97 134.56,32.97 JP2.5
BTN1_UP_SENSE
  Top 0.152: JP2.8 136.69,30.84 138.28,30.84 141.07,28.04 141.07,13.51 132.49,4.93 33.58,4.93 27.13,11.38 27.13,16.97 29.41,19.25 29.41,24.44 R14.1 29.11,25.41 Q9.D
BTN2_DOWN_CAP  (via drill 0.35)
  Top 0.152: 53.48,13.61 Q16.D
  Top 0.305: v52.5,16.8 53.37,15.93 Q15.G 52.29,14.82 52.29,14.8 | C8.1 52.29,14.8 | 52.29,14.8 53.48,13.61
  Bottom 0.305: D8.K v52.5,16.8
BTN2_DOWN_CLR  (via drill 0.35)
  Top 0.152: v138.7,14.8 138.7,14.1 131.6,7 50.4,7 49.3,8.1 49.3,10.91 R23.2 51.08,12.69 Q16.G
  Bottom 0.152: v138.7,14.8 138.7,18.5 137,20.2 134.63,20.2 JP2.15
BTN2_DOWN_SENSE
  Top 0.152: JP2.16 138,19.37 138,14 131.4,7.4 58.4,7.4 56.3,9.5 56.3,15.8 Q15.D 55.1,17 55.1,17.43 R24.1
BTN2_PIN1
  Bottom 0.152: 43.62,19.44 R19.2
  Bottom 0.305: U4.P$4 44.9,16.73 44.9,18.08 D7.A 43.62,19.44
  Bottom 0.457: U4.P$4 42.9,14.73 42.9,14.3 40.31,11.71 AF4.P$1
BTN2_PIN3
  Bottom 0.152: 49.39,13.59 50.51,12.47 R22.2
  Bottom 0.305: U4.P$3 46.71,15 47.98,15 D8.A 49.39,13.59
  Bottom 0.457: U4.P$3 44.61,12.9 44.3,12.9 41.71,10.31 AF4.P$2
BTN2_UP_CAP  (via drill 0.35)
  Top 0.305: Q13.G 43.48,23.55 Q14.D 43.61,23.48 C7.1 46.23,22.4 v46.63,22.4
  Bottom 0.305: D7.K 46.63,22.39 v46.63,22.4
BTN2_UP_CLR
  Top 0.152: Q14.G 40.2,21.54 40.2,21.02 R21.2 40.3,19.87 40.3,15.8 49.9,6.2 132,6.2 139.8,14 139.8,23.9 138.35,25.35 134.56,25.35 JP2.11
BTN2_UP_SENSE
  Top 0.152: JP2.13 134.57,22.8 137.5,22.8 139.4,20.9 139.4,14.2 131.8,6.6 50.2,6.6 45.2,11.6 45.2,17.1 47.4,19.3 47.4,24.4 47.75,24.75 R20.1 47.12,25.41 Q13.D
BTN3_DOWN_CAP  (via drill 0.35)
  Top 0.305: Q20.D 70.24,14.82 | 70.24,14.82 69.61,15.45 C10.1 | Q19.G 71.32,15.85 | 71.32,15.85 70.28,14.82 70.24,14.82 | v70.51,16.82 71.32,16 71.32,15.85
  Bottom 0.305: D10.K v70.51,16.81 v70.51,16.82
BTN3_DOWN_CLR
  Top 0.152: JP2.19 133.28,13.48 128.4,8.6 67.8,8.6 67.1,9.3 67.1,10.71 R29.2 69.08,12.69 Q20.G
BTN3_DOWN_SENSE  (via drill 0.35)
  Top 0.152: v131.9,13 127.91,9.01 74.8,9.01 74.3,9.51 74.3,15.8 Q19.D 73.1,17 73.1,17.43 R30.1
  Bottom 0.152: v131.9,13 134.1,13 135.82,14.72 JP2.20
BTN3_PIN1
  Bottom 0.152: 61.62,19.44 R25.2
  Bottom 0.305: U5.P$4 62.9,16.73 62.9,18.08 D9.A 61.62,19.44
  Bottom 0.457: U5.P$4 60.9,14.73 60.9,14.3 58.31,11.71 AF5.P$1
BTN3_PIN3
  Bottom 0.305: U5.P$3 64.71,15 65.98,15 D10.A 67.41,13.64 R28.2
  Bottom 0.457: U5.P$3 62.61,12.9 62.3,12.9 59.71,10.31 AF5.P$2
BTN3_UP_CAP  (via drill 0.35)
  Top 0.152: C9.1 64.28,22.45 v64.62,22.45 | 61.61,23.48 61.55,23.48 61.48,23.55 Q18.D
  Top 0.305: 61.61,23.48 C9.1 | Q17.G 61.48,23.55
  Bottom 0.152: v64.62,22.45 63.31,21.15 D9.K
BTN3_UP_CLR
  Top 0.152: Q18.G 58.2,21.54 58.2,21.02 R27.2 58.2,19.77 58.2,15.9 65.9,8.2 129.6,8.2 134.5,13.1 134.5,17.79 JP2.17
BTN3_UP_SENSE  (via drill 0.35)
  Top 0.152: v63.83,11.13 63.2,11.76 63.2,17.1 65.4,19.3 65.4,24.43 R26.1 65.11,25.41 Q17.D | v63.9,9.3 65.4,7.8 131.2,7.8 137.6,14.2 137.6,17.23 JP2.18
  Bottom 0.152: v63.83,11.13 63.83,9.37 v63.9,9.3
BTN4_DOWN_CAP  (via drill 0.35)
  Top 0.305: v16.51,34.8 17.37,33.94 Q23.G 17.37,33.78 16.34,32.75 | C12.1 16.34,32.75 | 16.34,32.75 17.48,31.61 Q24.D
  Bottom 0.305: D12.K 16.5,34.8 v16.51,34.8
BTN4_DOWN_CLR  (via drill 0.35)
  Top 0.152: R35.2 15.08,30.69 Q24.G 16,31.45 v16,31.9 | v23.93,46.63 23.93,51.87 25.15,53.09 51.01,53.09 52.28,51.82 84.85,51.82 87.63,49.03 87.63,36.89 89.31,35.2 89.33,35.2 JP1.5
  Bottom 0.152: v16,31.9 19.56,35.46 19.56,37.39 24.23,42.06 24.23,46.33 v23.93,46.63
BTN4_DOWN_SENSE  (via drill 0.35)
  Top 0.152: R36.1 19.1,35.43 19.1,35.01 Q23.D v20.42,35.61 | v24.89,46.6 24.89,52.32 25.29,52.73 50.87,52.73 52.14,51.46 84.7,51.46 87.27,48.88 87.27,35.2 89.46,33.02 91.51,33.02 JP1.8
  Bottom 0.152: v20.42,35.61 20.42,37.69 24.59,41.86 24.59,46.31 v24.89,46.6
BTN4_PIN1
  Bottom 0.152: R31.2 7.62,37.44 D11.A
  Bottom 0.305: D11.A 8.9,36.08 8.9,34.73 U6.P$4
  Bottom 0.457: U6.P$4 6.9,32.73 6.9,32.3 4.31,29.71 AF6.P$1
BTN4_PIN3
  Bottom 0.152: 14.51,30.48 13.39,31.59 D12.A
  Bottom 0.305: U6.P$3 10.71,33 11.98,33 13.39,31.59 | 14.51,30.48 R34.2
  Bottom 0.457: U6.P$3 8.61,30.9 8.3,30.9 5.71,28.31 AF6.P$2
BTN4_UP_CAP  (via drill 0.35)
  Top 0.305: v10.6,40.4 10.22,40.4 C11.1 9.32,39.63 Q22.D 8.61,42.6 Q21.G
  Bottom 0.305: D11.K 10.6,40.35 v10.6,40.4
BTN4_UP_CLR
  Top 0.152: R33.2 4.2,39.02 4.2,39.54 Q22.G 4.47,41.37 4.47,51.1 7.16,53.8 51.31,53.8 52.58,52.53 85.14,52.53 88.34,49.33 88.34,38.73 JP1.3
BTN4_UP_SENSE
  Top 0.152: JP1.6 91.51,35.56 89.46,35.56 87.99,37.03 87.99,49.18 84.99,52.17 52.43,52.17 51.16,53.44 10.92,53.44 9.75,52.27 9.75,44.35 Q21.D 11.12,43.41 R32.1
BTN5_DOWN_CAP  (via drill 0.35)
  Top 0.305: Q32.D 34.26,32.79 | 34.26,32.79 33.6,33.45 C16.1 | 34.26,32.79 34.26,32.8 Q31.G 34.49,34.78 v34.49,34.8
  Bottom 0.305: D16.K v34.49,34.79 v34.49,34.8
BTN5_DOWN_CLR  (via drill 0.35)
  Top 0.152: 33.08,30.69 R47.2 | Q32.G 33.98,31.43 33.98,31.85 v34.04,31.9 | v42.11,46.63 42.11,50.85 42.93,51.66 50.42,51.66 51.69,50.39 84.26,50.39 86.21,48.44 86.21,33.24 JP1.9
  Top 0.305: Q32.G 33.08,30.69
  Bottom 0.152: v34.04,31.9 37.54,35.41 37.54,37.39 42.42,42.27 42.42,46.33 v42.11,46.63
BTN5_DOWN_SENSE  (via drill 0.35)
  Top 0.152: R48.1 37.1,35.43 37.1,35.01 Q31.D 38.3,35.49 v38.3,35.51 | v43.12,46.63 43.12,50.59 43.84,51.31 50.28,51.31 51.55,50.04 84.11,50.04 85.85,48.3 85.85,31.7 89.66,27.89 91.56,27.89 JP1.12
  Bottom 0.152: v38.3,35.51 38.3,37.65 42.77,42.12 42.77,46.28 v43.12,46.63
BTN5_PIN1
  Bottom 0.305: U8.P$4 26.9,34.73 26.9,36.08 D15.A 25.61,37.44 R43.2
  Bottom 0.457: U8.P$4 24.9,32.73 24.9,32.3 22.31,29.71 AF8.P$1
BTN5_PIN3
  Bottom 0.152: R46.2 31.41,31.64 D16.A
  Bottom 0.305: U8.P$3 28.71,33 29.98,33 D16.A
  Bottom 0.457: U8.P$3 26.61,30.9 26.3,30.9 23.71,28.31 AF8.P$2
BTN5_UP_CAP  (via drill 0.35)
  Top 0.305: v28.6,40.39 28.21,40.39 C15.1 25.61,41.48 Q30.D 26.61,42.6 Q29.G
  Bottom 0.305: D15.K 28.6,40.35 v28.6,40.39
BTN5_UP_CLR
  Top 0.152: R45.2 22.2,39.02 22.2,39.54 Q30.G 25.65,43 25.65,51.92 26.11,52.38 50.72,52.38 51.99,51.1 84.55,51.1 86.92,48.74 86.92,35.06 89.31,32.66 89.33,32.66 JP1.7
BTN5_UP_SENSE
  Top 0.152: R44.1 29.11,43.41 Q29.D 27.03,45.08 27.03,51.05 27.99,52.02 50.57,52.02 51.84,50.75 84.4,50.75 86.56,48.59 86.56,33.53 89.66,30.43 91.56,30.43 JP1.10
BTN6_DOWN_CAP  (via drill 0.35)
  Top 0.152: v52.53,34.8 53.37,33.95 Q39.G 52.28,32.81 52.27,32.81 | C20.1 52.27,32.81 | 52.27,32.81 53.48,31.61 Q40.D
  Bottom 0.152: D20.K 52.5,34.8 v52.53,34.8
BTN6_DOWN_CLR  (via drill 0.35)
  Top 0.152: R59.2 51.01,30.62 51.18,30.62 Q40.G 52.02,31.46 v52.02,31.85 | v60.15,46.28 60.15,48.16 60.96,48.97 83.67,48.97 84.78,47.85 84.78,31.8 v84.38,31.39
  Bottom 0.152: v52.02,31.85 55.27,35.1 55.27,37.08 60.4,42.22 60.4,46.02 v60.15,46.28 | v84.38,31.39 84.38,22.37 JP1.19
BTN6_DOWN_SENSE  (via drill 0.35)
  Top 0.152: R60.1 55.1,35.43 55.1,35.01 Q39.D 56.17,35.36 v56.19,35.36 | v61.11,46.28 61.11,48.05 61.67,48.62 83.52,48.62 84.43,47.71 84.43,32.46 83.72,31.75 83.72,28.75 89.66,22.81 91.56,22.81 JP1.16
  Bottom 0.152: v56.19,35.36 56.19,37.49 60.76,42.07 60.76,45.96 61.08,46.28 v61.11,46.28
BTN6_PIN1
  Bottom 0.152: R55.2 43.62,37.44 D19.A
  Bottom 0.305: U10.P$4 44.9,34.73 44.9,36.08 D19.A
  Bottom 0.457: U10.P$4 42.9,32.73 42.9,32.3 40.31,29.71 AF10.P$1
BTN6_PIN3
  Bottom 0.152: R58.2 49.41,31.64 D20.A
  Bottom 0.305: U10.P$3 46.71,33 48.05,33 49.41,31.64
  Bottom 0.457: U10.P$3 44.61,30.9 44.3,30.9 41.71,28.31 AF10.P$2
BTN6_UP_CAP  (via drill 0.35)
  Top 0.305: Q37.G 43.48,41.55 Q38.D 45.32,39.63 C19.1 46.26,40.44 v46.63,40.44
  Bottom 0.305: D19.K 46.63,40.39 v46.63,40.44
BTN6_UP_CLR
  Top 0.152: R57.2 40.2,39.02 40.2,39.54 Q38.G 43.89,43.23 43.89,50.34 44.5,50.95 50.13,50.95 51.4,49.68 83.96,49.68 85.5,48.15 85.5,31.41 JP1.11
BTN6_UP_SENSE
  Top 0.152: R56.1 47.12,43.41 Q37.D 44.55,45.55 44.55,50.04 45.11,50.6 49.98,50.6 51.25,49.33 83.81,49.33 85.14,48 85.14,29.82 89.61,25.35 91.56,25.35 JP1.14
BTN7_DOWN_CAP  (via drill 0.35)
  Top 0.152: v70.51,34.8 71.37,33.94 Q47.G 70.29,32.82 70.29,32.8 | C24.1 70.29,32.8 | 70.29,32.8 71.48,31.61 Q48.D
  Bottom 0.152: D24.K 70.5,34.8 v70.51,34.8
BTN7_DOWN_CLR  (via drill 0.35)
  Top 0.152: v67.11,28.7 67.11,28.72 R71.2 69.08,30.69 Q48.G | v80.87,24.18 86.04,19.01 JP1.17
  Bottom 0.152: v67.11,28.7 68.17,29.77 69.6,29.77 70.76,30.94 73.61,30.94 74.83,29.72 75.34,29.72 v80.87,24.18
BTN7_DOWN_SENSE
  Top 0.152: R72.1 73.1,35.43 73.1,35.01 Q47.D 80.16,27.94 80.16,23.22 85.6,17.78 91.51,17.78 JP1.20
BTN7_PIN1
  Bottom 0.152: R67.2 61.62,37.44 D23.A
  Bottom 0.305: D23.A 62.9,36.08 62.9,34.73 U12.P$4
  Bottom 0.457: U12.P$4 60.9,32.73 60.9,32.3 58.31,29.71 AF12.P$1
BTN7_PIN3
  Bottom 0.152: R70.2 68.51,30.48 D24.A
  Bottom 0.305: U12.P$3 64.71,33 65.98,33 D24.A
  Bottom 0.457: U12.P$3 62.61,30.9 62.3,30.9 59.71,28.31 AF12.P$2
BTN7_UP_CAP  (via drill 0.35)
  Top 0.152: 61.61,41.48 Q46.D 61.48,41.55 | v64.62,40.39 64.21,40.39 C23.1
  Top 0.305: 61.61,41.48 C23.1 | 61.48,41.55 Q45.G
  Bottom 0.152: D23.K 64.62,40.37 v64.62,40.39
BTN7_UP_CLR
  Top 0.152: R69.2 58.2,39.02 58.2,39.54 Q46.G 61.98,43.32 61.98,47.75 62.48,48.26 83.37,48.26 84.07,47.56 84.07,32.66 83.31,31.9 83.31,28.55 90.28,21.58 JP1.15
BTN7_UP_SENSE  (via drill 0.35)
  Top 0.152: R68.1 65.11,43.41 Q45.D 62.53,45.57 62.53,47.45 62.99,47.9 67.72,47.9 v68.22,47.4 | v74.78,47.6 82.95,47.6 83.72,46.84 83.72,32.87 82.91,32.05 82.91,27.03 89.66,20.27 91.56,20.27 JP1.18
  Bottom 0.152: v68.22,47.4 69.29,48.46 73.92,48.46 v74.78,47.6
GND  (via drill 0.35)
  other vias: 15.5,17.9 6.2,18.9 10.7,24.1 19.5,15.3 15.2,10.1 13.7,19.7 7.7,22.2 33.5,17.9 24.2,18.9 28.7,24.1 37.5,15.3 33.2,10.1 31.7,19.7 25.7,22.2 51.5,17.9 42.2,18.9 46.7,24.1 55.5,15.3 51.2,10.1 49.7,19.7 43.7,22.2 69.5,17.9 60.2,18.9 64.7,24.1 73.5,15.3 69.2,10.1 67.7,19.7 61.7,22.2 15.5,37.8 15.5,35.9 6.2,36.9 10.7,42.1 19.5,33.3 15.2,28.1 13.7,37.7 7.7,40.2 33.5,37.8 33.5,35.9 24.2,36.9 27.89,42.67 37.5,33.3 33.2,28.1 31.7,37.7 25.76,40.18 51.5,37.8 51.5,35.9 42.2,36.9 45.97,42.72 55.5,33.3 51.2,28.1 49.7,37.7 43.7,40.2 69.5,37.8 69.5,35.9 60.2,36.9 63.96,42.67 73.5,33.3 69.2,28.1 67.7,37.7 61.7,40.2 60.76,55.17 60.76,53.95 64.16,57.15 66.8,53.59 63.75,62.13 63.75,60.4 60.35,58.01 59.54,57.05 60.2,59.33 8.41,52.82 13.65,52.72 13.7,54.75 23.35,52.77 18.57,52.72 18.52,54.85 26.19,54.8 32.54,54.95 42.2,55 31.95,50.7 40.59,50.85 26.5,51.65 49.58,48.31 49.63,45.01 47.24,48.87 47.14,45.47
  pour Top: 0,-2 151,-2 151,68 0,68
  pour Bottom: 0,-3 150,-3 150,67 0,67
HARVEST  (via drill 0.35)
  Top 0.152: C21.1 C18.1 28.42,58.55 28.87,58.1 C13.1 C14.1 C17.1 | U1.3 61.4,60.94 v61.37,60.91 | U7.1 58.89,55.51 58.63,55.77 C26.1 v58.12,56.79 | v58.12,53.29 58.44,53.61 U7.3
  Top 0.305: v11.1,29.1 9.8,30.4 9.8,31.7 11.9,33.8 v11.9,39.4 | v29.1,29.1 27.8,30.4 27.8,31.7 29.9,33.8 v29.9,39.4 | v47.1,29.1 45.8,30.4 45.8,31.7 47.9,33.8 v47.9,39.4 | v65.1,29.1 63.8,30.4 63.8,31.7 65.9,33.8 v65.9,39.4 | C13.1 30,56.46 v30.48,55.98 | C17.1 37.17,58.1 37.55,58.48 C25.+ C22.+ 47.69,58.48 52.05,54.12 JP4.5 55.85,54.12 57.19,55.46 57.2,55.46 57.2,55.73 | 57.2,55.73 57.2,60.76 v58.78,62.33 58.79,62.32 C2.1 60.38,62.24 U1.1 | C26.1 57.24,55.77 57.2,55.73
  Bottom 0.152: 11.9,39.36 v11.9,39.4 | v61.37,60.91 60.2,60.91 v58.78,62.33 | v58.12,56.79 v58.12,53.29
  Bottom 0.305: U2.P$1 11.9,21.36 11.9,28.3 v11.1,29.1 | U6.P$1 11.9,39.36 | v11.9,39.4 11.9,40.65 12.5,41.25 12.5,55.02 13.46,55.98 v30.48,55.98 | U10.P$1 47.9,39.36 v47.9,39.4 47.9,40.65 48.46,41.22 48.46,49.33 | U8.P$1 29.9,39.36 v29.9,39.4 29.9,40.65 30.5,41.25 30.5,55.97 v30.48,55.98 | v29.1,29.1 29.9,28.3 29.9,24.71 31.39,23.22 31.39,21.22 U3.P$1 | v47.1,29.1 47.9,28.3 47.9,24.69 49.43,23.16 49.43,21.26 U4.P$1 | v65.1,29.1 65.9,28.3 65.9,24.83 67.41,23.32 67.41,21.24 U5.P$1 | U12.P$1 65.9,39.36 v65.9,39.4 65.9,40.65 66.5,41.25 66.5,46.84 64.01,49.33 48.46,49.33 | v30.48,55.98 47.5,55.98 48.46,55.02 48.46,49.33
N$3
  Top 0.152: R2.2 65.43,54.81 65.23,54.61 63.75,54.61 63.6,54.46 R1.1 63.45,53.61 U7.4
N$4
  Top 0.152: U1.5 65.01,59.96 65.28,59.69 C27.2 65.23,59.23 R3.1 64.21,58.85 64.11,58.75 63.77,58.75 63.71,58.7 63.3,58.7 63.2,58.59 R4.2
N$5
  Top 0.305: U1.7 L1.P$1
PGOOD  (via drill 0.35)
  Top 0.152: U1.6 65.96,60.94 66.95,59.94 67.51,59.94 | 67.51,59.94 R5.1 | v67.51,58.88 67.51,59.94
  Bottom 0.152: JP3.4 71.1,56.66 68.89,58.88 v67.51,58.88
VCC  (via drill 0.35)
  Top 0.152: R5.2 69.6,59.94 | R3.2 64.56,58.23 64.81,57.97 C27.1 v65.28,57 | 63.55,55.51 R1.2 | C1.1 U7.5 | U1.4 61.71,60.29 v61.37,59.94 | C28.1 65.16,64.33 64.92,64.57 v62.79,64.57
  Top 0.305: R32.2 12.75,43.2 12.75,41.75 17.9,36.6 18.6,36.6 18.8,36.8 19.14,36.8 R36.2 20,36.88 v21.18,36.88 | R44.2 30.8,43.14 30.8,42.84 30.8,42.16 | 74.42,37.03 74.15,37.03 R72.2 73.2,36.75 72.02,36.75 66.75,42.01 | R56.2 48.8,43.14 48.8,42.84 48.8,41.83 | 30.8,42.16 30.8,41.91 35.93,36.78 37.16,36.78 R48.2 38.05,36.93 v39.06,36.93 | v29.64,41.49 30.3,42.16 30.8,42.16 | R68.2 66.75,43.19 66.75,42.01 | v65.64,41.49 66.15,42.01 66.75,42.01 | 48.8,41.83 53.88,36.75 55.2,36.75 R60.2 56.05,36.93 v57,36.93 | v47.63,41.49 48.46,41.49 48.8,41.83 | 74.27,19 74.11,19 R30.2 73.2,18.75 70.92,18.75 66.75,22.91 | R14.2 30.79,25.16 30.79,23.06 | v30.18,22.4 30.79,23.01 30.79,23.06 | R20.2 48.77,25.18 48.77,23.01 | v48.21,22.45 48.77,23.01 | 30.79,23.06 35.1,18.75 37.2,18.75 R18.2 38.25,19.14 v38.25,19.15 | v20.37,19.25 R12.2 19.2,18.75 17.32,18.75 12.75,23.32 12.75,25.19 R8.2 | 48.77,23.01 52.98,18.8 55.15,18.8 R24.2 56.32,19.2 v56.39,19.2 | R26.2 66.75,25.19 66.75,22.91 | v66.19,22.35 66.75,22.91 | U1.8 65.16,62.4 C28.1 65.79,63.55 66.04,63.8 67.39,63.8 L1.P$2 69.21,63.79 69.6,63.4 69.6,59.94 v69.6,57 69.6,56.29 | JP3.5 70.14,54.12 69.6,54.66 69.6,56.29 | U7.5 63.55,55.51 | R1.2 63.6,56.13 63.75,56.29 69.6,56.29
  Top 0.457: 74.42,37.03 76.91,37.03 v79.3,39.42 | JP3.5 87.87,54.12 90.28,51.71 JP1.1 | 74.27,19 77.06,19 v78.49,20.42
  Bottom 0.152: v65.28,57 v69.6,57 | v61.37,59.94 62.03,60.6 62.03,63.8 v62.79,64.57
  Bottom 0.305: v21.18,36.88 21.18,37.84 24.83,41.49 v29.64,41.49 | v39.06,36.93 39.06,37.69 42.87,41.49 v47.63,41.49 | v57,36.93 57,37.64 60.85,41.49 v65.64,41.49 | v20.37,19.25 24.48,23.37 29.21,23.37 v30.18,22.4 | v38.25,19.15 42.42,23.32 47.35,23.32 v48.21,22.45 | v56.39,19.2 60.55,23.37 61.57,23.37 65.18,23.37 v66.19,22.35
  Bottom 0.457: v79.3,39.42 82.6,39.42 | 82.6,39.42 90.19,39.42 JP1.1 | v78.49,20.42 81.23,20.42 82.6,21.79 82.6,39.42

### Text on the board
tPlace: sgnd cut | gnd | gnd | BUCK | harvest bank | gnd | nc | nc | nc | nc | pgood | LDO | vin | vcc | MSP430FR5994
tDocu: optional / power reg